# Altium schematic sheet DiffInput.SchDoc: Наименование
size 420 x 297 mm; ApprovedBy: Сидоров; CheckedBy: Петров; Author: Иванов; CompanyName: РГППУ; Title2str: Изделия; DecimalNumber: АБВГ.123456.001 33
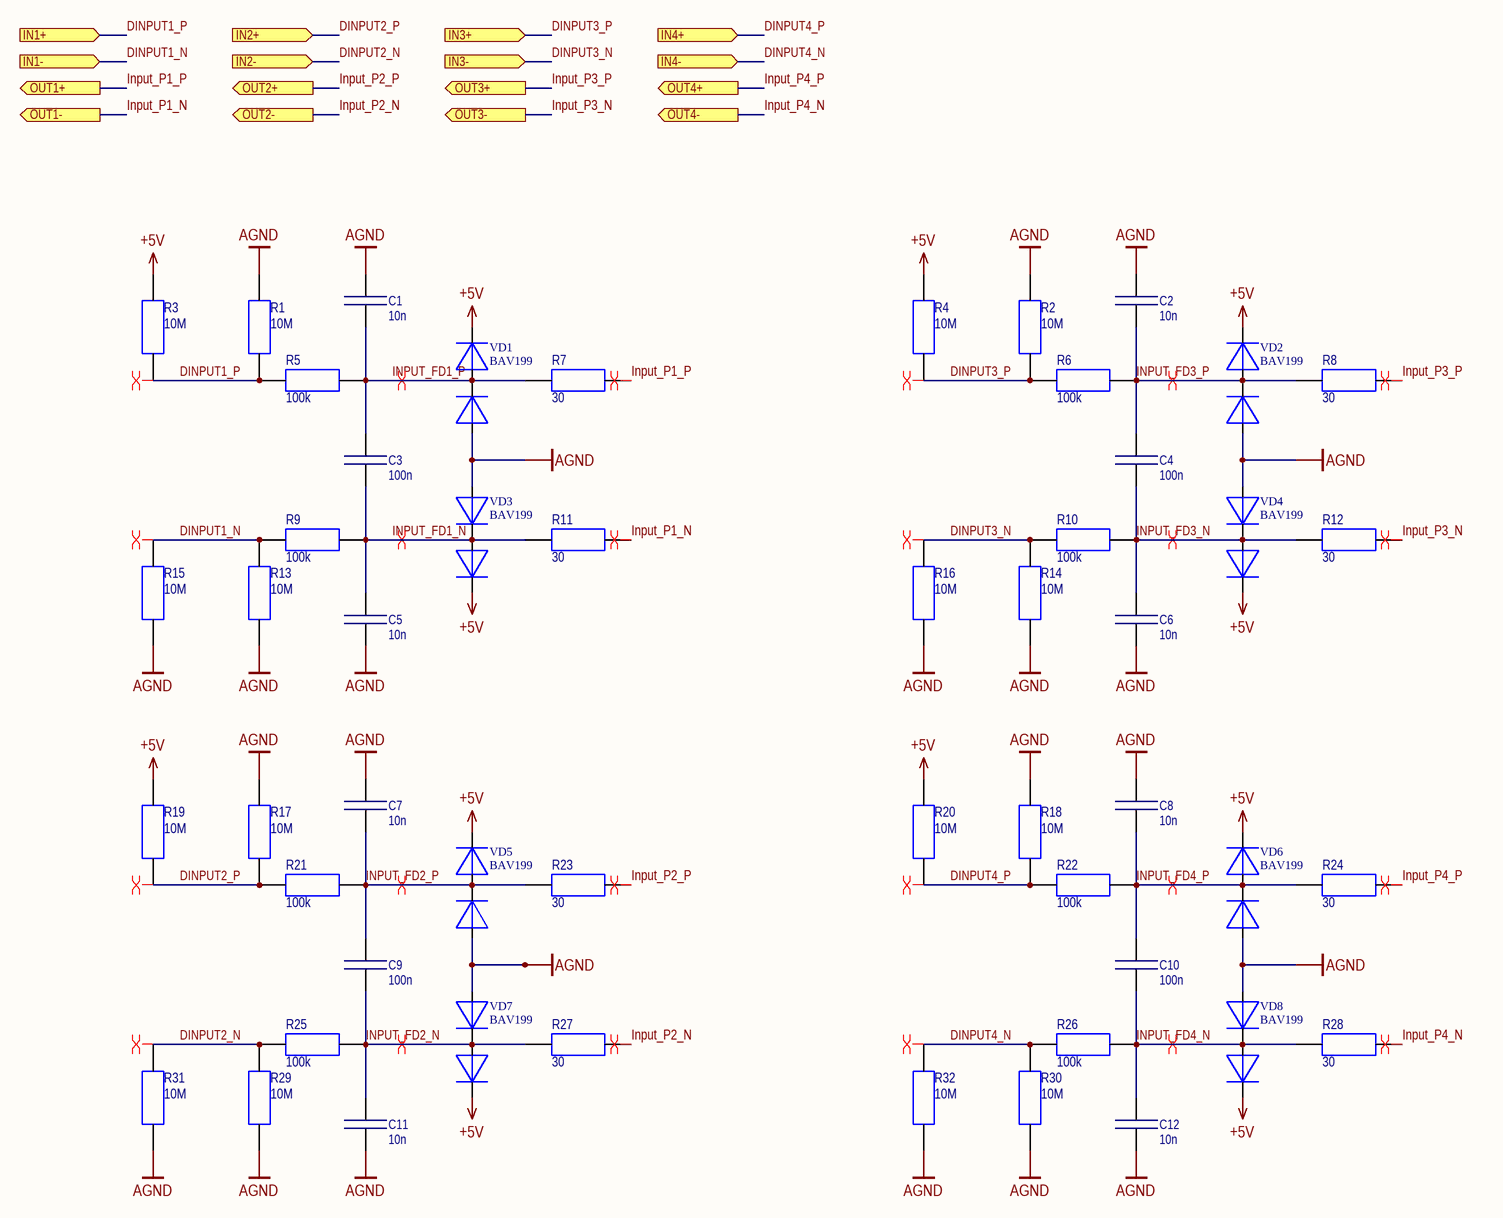
[diagram p0: DiffInput.SchDoc]

## Parts
C1  10n  [SMDRC0805]
C2  10n  [SMDRC0805]
C3  100n  [SMDRC0805]
C4  100n  [SMDRC0805]
C5  10n  [SMDRC0805]
C6  10n  [SMDRC0805]
C7  10n  [SMDRC0805]
C8  10n  [SMDRC0805]
C9  100n  [SMDRC0805]
C10  100n  [SMDRC0805]
C11  10n  [SMDRC0805]
C12  10n  [SMDRC0805]
R1  10M  [SMDRC0805]
R2  10M  [SMDRC0805]
R3  10M  [SMDRC0805]
R4  10M  [SMDRC0805]
R5  100k  [SMDRC0805]
R6  100k  [SMDRC0805]
R7  30  [SMDRC0805]
R8  30  [SMDRC0805]
R9  100k  [SMDRC0805]
R10  100k  [SMDRC0805]
R11  30  [SMDRC0805]
R12  30  [SMDRC0805]
R13  10M  [SMDRC0805]
R14  10M  [SMDRC0805]
R15  10M  [SMDRC0805]
R16  10M  [SMDRC0805]
R17  10M  [SMDRC0805]
R18  10M  [SMDRC0805]
R19  10M  [SMDRC0805]
R20  10M  [SMDRC0805]
R21  100k  [SMDRC0805]
R22  100k  [SMDRC0805]
R23  30  [SMDRC0805]
R24  30  [SMDRC0805]
R25  100k  [SMDRC0805]
R26  100k  [SMDRC0805]
R27  30  [SMDRC0805]
R28  30  [SMDRC0805]
R29  10M  [SMDRC0805]
R30  10M  [SMDRC0805]
R31  10M  [SMDRC0805]
R32  10M  [SMDRC0805]
VD1  BAV199  [SOT23 (TO-236AB)]
VD2  BAV199  [SOT23 (TO-236AB)]
VD3  BAV199  [SOT23 (TO-236AB)]
VD4  BAV199  [SOT23 (TO-236AB)]
VD5  BAV199  [SOT23 (TO-236AB)]
VD6  BAV199  [SOT23 (TO-236AB)]
VD7  BAV199  [SOT23 (TO-236AB)]
VD8  BAV199  [SOT23 (TO-236AB)]

## Ports
IN1+ (in), IN1- (in), IN2+ (in), IN2- (in), IN3+ (in), IN3- (in), IN4+ (in), IN4- (in), OUT1+ (out), OUT1- (out), OUT2+ (out), OUT2- (out), OUT3+ (out), OUT3- (out), OUT4+ (out), OUT4- (out)

## Nets
+5V: R3.2 R4.2 R19.2 R20.2 VD1.2 VD2.2 VD3.2 VD4.2 VD5.2 VD6.2 VD7.2 VD8.2
AGND: C1.2 C2.2 C5.1 C6.1 C7.2 C8.2 C11.1 C12.1 R1.2 R2.2 R13.1 R14.1 R15.1 R16.1 R17.2 R18.2 R29.1 R30.1 R31.1 R32.1 VD1.1 VD2.1 VD3.1 VD4.1 VD5.1 VD6.1 VD7.1 VD8.1
DINPUT1_N: R9.1 R13.2 R15.2 ; port IN1-
DINPUT1_P: R1.1 R3.1 R5.1 ; port IN1+
DINPUT2_N: R25.1 R29.2 R31.2 ; port IN2-
DINPUT2_P: R17.1 R19.1 R21.1 ; port IN2+
DINPUT3_N: R10.1 R14.2 R16.2 ; port IN3-
DINPUT3_P: R2.1 R4.1 R6.1 ; port IN3+
DINPUT4_N: R26.1 R30.2 R32.2 ; port IN4-
DINPUT4_P: R18.1 R20.1 R22.1 ; port IN4+
INPUT_FD1_N: C3.1 C5.2 R9.2 R11.1 VD3.3
INPUT_FD1_P: C1.1 C3.2 R5.2 R7.1 VD1.3
INPUT_FD2_N: C9.1 C11.2 R25.2 R27.1 VD7.3
INPUT_FD2_P: C7.1 C9.2 R21.2 R23.1 VD5.3
INPUT_FD3_N: C4.1 C6.2 R10.2 R12.1 VD4.3
INPUT_FD3_P: C2.1 C4.2 R6.2 R8.1 VD2.3
INPUT_FD4_N: C10.1 C12.2 R26.2 R28.1 VD8.3
INPUT_FD4_P: C8.1 C10.2 R22.2 R24.1 VD6.3
Input_P1_N: R11.2 ; port OUT1-
Input_P1_P: R7.2 ; port OUT1+
Input_P2_N: R27.2 ; port OUT2-
Input_P2_P: R23.2 ; port OUT2+
Input_P3_N: R12.2 ; port OUT3-
Input_P3_P: R8.2 ; port OUT3+
Input_P4_N: R28.2 ; port OUT4-
Input_P4_P: R24.2 ; port OUT4+

## Layout directives
differential pair: DINPUT1_N, DINPUT1_P, DINPUT2_N, DINPUT2_P, DINPUT3_N, DINPUT3_P, DINPUT4_N, DINPUT4_P, INPUT_FD1_N, INPUT_FD1_P, INPUT_FD2_N, INPUT_FD2_P, INPUT_FD3_N, INPUT_FD3_P, INPUT_FD4_N, INPUT_FD4_P, Input_P1_N, Input_P1_P, Input_P2_N, Input_P2_P, Input_P3_N, Input_P3_P, Input_P4_N, Input_P4_P

## Notes on the sheet
- Изм.
- Лист
- N*докум.
- Подп.
- Дата
- Лит.
- Масса
- Масштаб
- Разраб.
- Пров.
- Т.контр.
- Лиcт
- Лиcтов
- Н.контр.
- Утв.

## Library data of the parts
C1 C2 C5-C8 C11 C12 = Capacitor 0805 10n: Generic capasitor non-polar; PartNumber: Capacitor 0805 10n; Value: 10n; ComponentLink1Description: Datasheet; Package: 0805
C3 C4 C9 C10 = Capacitor 0805 100n: Generic capasitor non-polar; PartNumber: Capacitor 0805 100n; Value: 100n; ComponentLink1Description: Datasheet; Package: 0805
R1-R4 R13-R20 R29-R32 = Resistor 0805 10M: Generic resistor; PartNumber: Resistor 0805 10M; Value: 10M; ComponentLink1URL: http://www.mouser.com/ds/2/447/PYu-RC0402_51_RoHS_L_6_r-8721.pdf; ComponentLink1Description: Datasheet; Package: 0805
R5 R6 R9 R10 R21 R22 R25 R26 = Resistor 0805 100k: Generic resistor; PartNumber: Resistor 0805 100k; Value: 100k; ComponentLink1URL: http://www.mouser.com/ds/2/447/PYu-RC0402_51_RoHS_L_6_r-8721.pdf; ComponentLink1Description: Datasheet; Package: 0805
R7 R8 R11 R12 R23 R24 R27 R28 = Resistor 0805 30: Generic resistor; PartNumber: Resistor 0805 30; Value: 30; ComponentLink1URL: http://www.mouser.com/ds/2/447/PYu-RC0402_51_RoHS_L_6_r-8721.pdf; ComponentLink1Description: Datasheet; Package: 0805
VD1-VD8 = BAV199: Epitaxial, medium-speed switching,  double diode in a small SOT23 plastic  SMD package. The diodes are  connected in series.; Manufacturer: NXP; ManufacturerPartNumber: BAV199; Cost: 0.73; ComponentLink1Description: Datasheet; Package: SOT23; Supplier: Промэлектроника; ComponentLink1URL: http://www.nxp.com/documents/data_sheet/BAV199.pdf